# Altium schematic sheet switch-acdetect.SchDoc
size A4
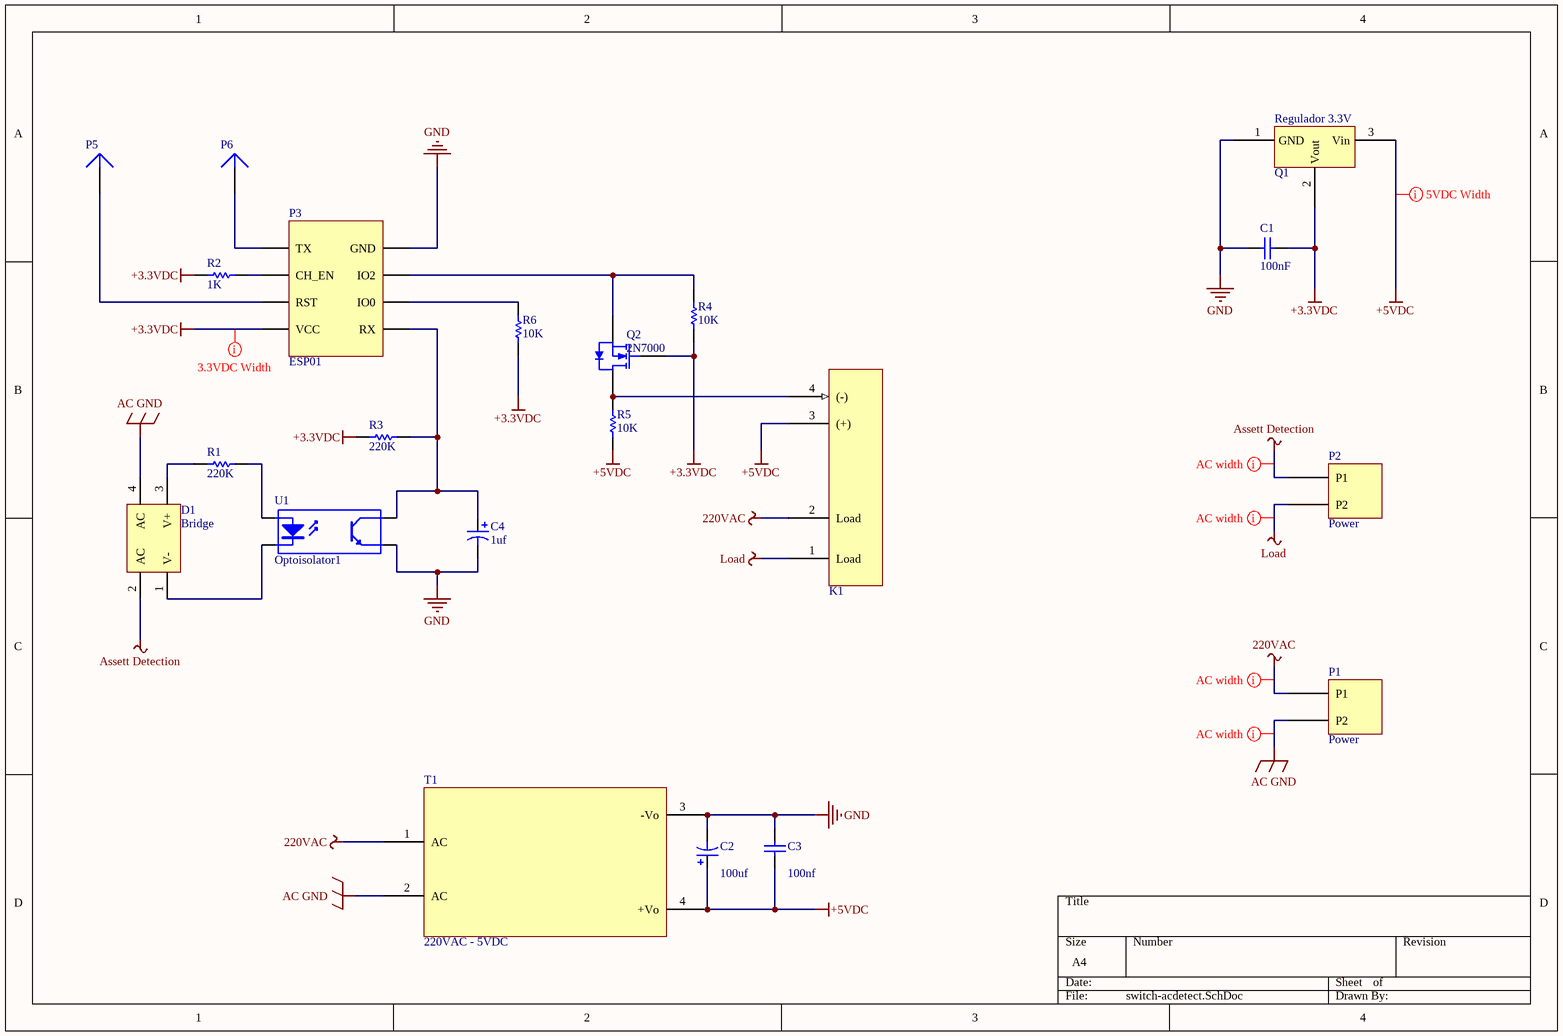
[diagram p0: switch-acdetect.SchDoc]

## Parts
C1  100nf  [RAD-0.1]
C2  value 100uf  [RAD-0.1]  (hidden comment: Cap Pol1)
C3  value 100nf  [RAD-0.1]  (hidden comment: Cap)
C4  value 1uf  [RAD-0.1]  (hidden comment: Cap Pol1)
D1  Bridge  [DB157]
K1  G3MB-202P DC5  [G3MB-202P DC5]  (value not drawn)
P1  Power  [ScrewTerminal-X2]
P2  Power  [ScrewTerminal-X2]
P3  ESP01  [HDR2X4]
P5  Plug  [PIN1]  (value not drawn)
P6  Plug  [PIN1]  (value not drawn)
Q1  Regulador 3.3V  [TO-220-AB]
Q2  2N7000  [TO-92]
R1  value 220K  [AXIAL-0.3]  (hidden comment: 10K)
R2  value 1K  [AXIAL-0.3]  (hidden comment: 10K)
R3  value 220K  [AXIAL-0.3]  (hidden comment: 10K)
R4  10K  [AXIAL-0.3]
R5  10K  [AXIAL-0.3]
R6  10K  [AXIAL-0.3]
T1  220VAC - 5VDC  [HLK-PM]
U1  Optoisolator1  [DIP-4]

## Nets
220VAC: K1.2(Load) P1.1(P1) T1.1(AC)
+3.3VDC: C1.2 P3.4(VCC) Q1.2(Vout) Q2.2(G) R2.1 R3.1 R4.2 R6.1
+5VDC: C2.1 C3.1 K1.3((+)) Q1.3(Vin) R5.2 T1.4(+Vo)
AC GND: D1.4(AC) P1.2(P2) T1.2(AC)
Assett Detection: D1.2(AC) P2.1(P1)
GND: C1.1 C2.2 C3.2 C4.2 P3.5(GND) Q1.1(GND) T1.3(-Vo) U1.3(E)
Load: K1.1(Load) P2.2(P2)
NetC4_1: C4.1 P3.8(RX) R3.2 U1.4(C)
NetD1_1: D1.1(V-) U1.2(K)
NetD1_3: D1.3(V+) R1.1
NetK1_4: K1.4((-)) Q2.1(D) R5.1
NetP3_1: P3.1(TX) P6.1
NetP3_2: P3.2(CH_EN) R2.2
NetP3_3: P3.3(RST) P5.1
NetP3_6: P3.6(IO2) Q2.3(S) R4.1
NetP3_7: P3.7(IO0) R6.2
NetR1_2: R1.2 U1.1(A)

## Layout directives
rule Width Constraint [Pref Width = 0.75mm    Min Width = 0.5mm    Max Width = 0.762mm]: +5VDC
rule Width Constraint [Pref Width = 0.75mm    Min Width = 0.5mm    Max Width = 75mm]: +3.3VDC
rule Width Constraint [Pref Width = 1.5mm    Min Width = 1.5mm    Max Width = 1.5mm]: 220VAC, AC GND, Assett Detection, Load

## Library data of the parts
C1 C3 = Cap: Capacitor; Published: 8-Jun-2000; LatestRevisionDate: 17-Jul-2002; LatestRevisionNote: Re-released for DXP Platform.; PackageReference: RAD-0.3; Publisher: Altium Limited; PackageDescription: Radial Cap, Thru-Hole; 2 Leads; 0.3 in Pin Spacing
  C1: Value: 100nF
C2 C4 = Cap Pol1: Polarized Capacitor (Radial); Published: 8-Jun-2000; LatestRevisionDate: 17-Jul-2002; LatestRevisionNote: Re-released for DXP Platform.; PackageReference: RB7.6-15; Publisher: Altium Limited; PackageDescription: Polarized Capacitor (Radial); 2 Leads
D1 = Bridge2: Diode Bridge; pin to pad: 1>4 4>1; Published: 24-Mar-1999; LatestRevisionDate: 17-Jul-2002; LatestRevisionNote: Re-released for DXP Platform.; PackageReference: D-46_6A; Publisher: Altium Limited; PackageDescription: Bridge Rectifier; 4 Terminals; Body 16.8 x 16.8 mm (typ); Pitch 10.67 mm
K1 = G3MB-202P DC5: RELAY MINI SSR 240VAC@2A ZERO; Mfr: Omron; Mfr PN: G3MB-202P DC5
P1 P2 = ScrewTerminal
P3 = ESP01: pin to pad: 1>8 2>6 3>4 4>2 5>7 6>5 7>3 8>1
Q1 = AMS1117
Q2 = 2N7000: N-channel Enhancement Mode Field-effect Transistor; Published: 17-Sep-2003; LatestRevisionDate: 12-Dec-2006; LatestRevisionNote: Footprint pad sequence fixed.; DatasheetVersion: 19-May-2000; PackageVersion: Feb-1997; PackageReference: SOT54; Publisher: Altium Limited; PackageDescription: Plastic Single-Ended Leaded (through hole) package; 3 Leads (TO-92); Code_JEITA: SC-43; Code_JEDEC: TO-92; ComponentLink1Description: Manufacturer Link; ComponentLink1URL: http://www.semiconductors.philips.com/; ComponentLink2Description: Datasheet; ComponentLink2URL: http://www.semiconductors.philips.com/acrobat/datasheets/2N7000-03.pdf
R1-R6 = Res1: Resistor; Published: 8-Jun-2000; LatestRevisionDate: 17-Jul-2002; LatestRevisionNote: Re-released for DXP Platform.; PackageReference: AXIAL-0.3; Publisher: Altium Limited; PackageDescription: Axial Device, Thru-Hole; 2 Leads; 0.3 in Pin Spacing
  R4-R6: Value: 10K
T1 = HLK-PM: HLK-PM*; Mfr: HLK-PM01
U1 = Optoisolator1: 4-Pin Phototransistor Optocoupler; Published: 24-Mar-1999; LatestRevisionDate: 04-Mar-2005; LatestRevisionNote: Sch pins 3 & 4 Swapped.; DatasheetVersion: Nov-2003; PackageReference: DIP-4; Publisher: Altium Limited
P5 P6 = Plug: LatestRevisionDate: 17-Jul-2002; LatestRevisionNote: Re-released for DXP Platform.; Publisher: Altium Limited